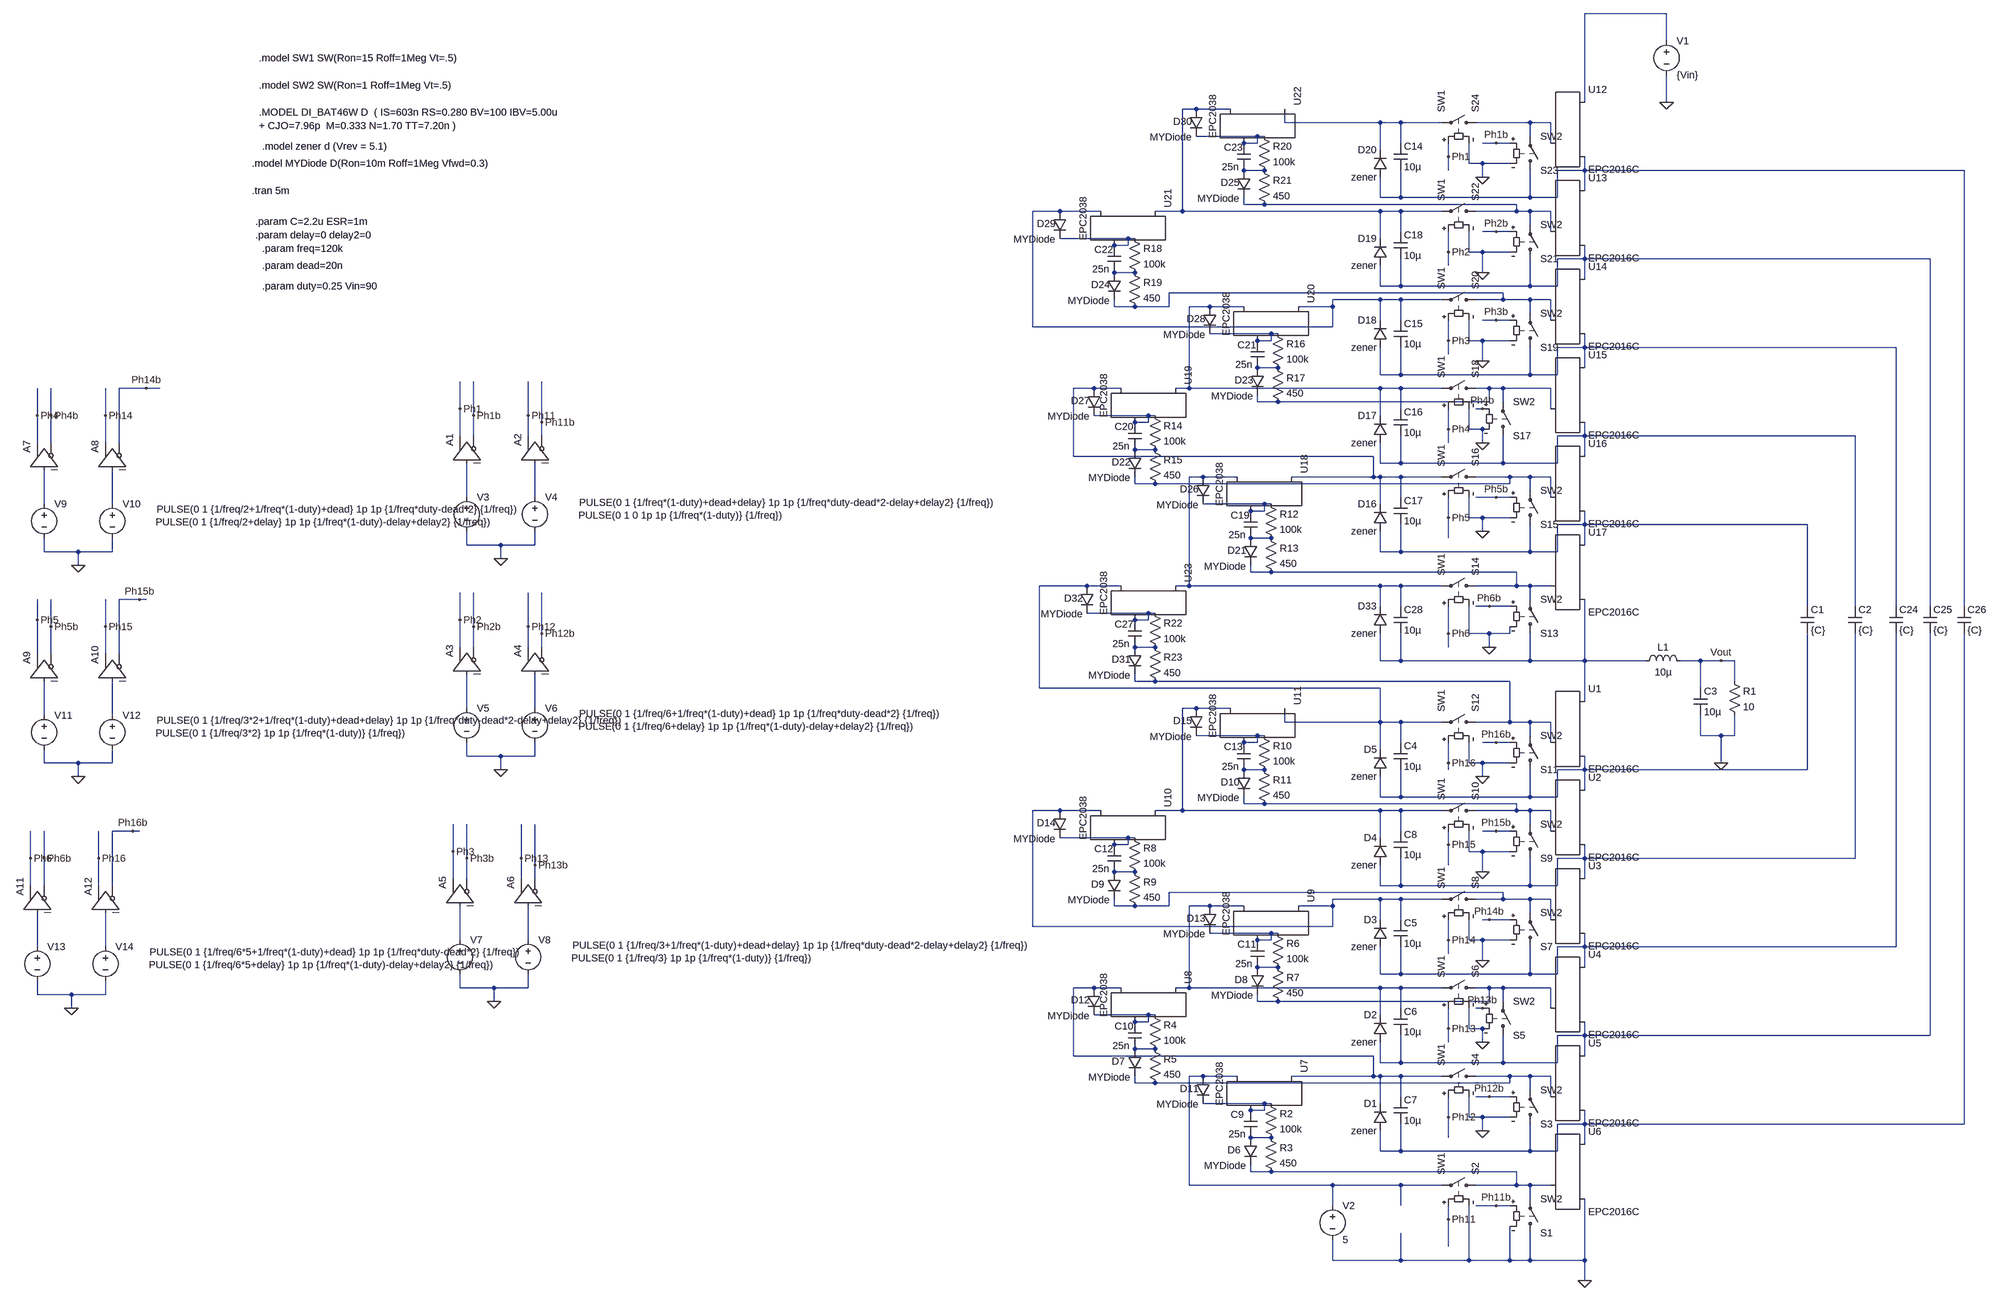
[diagram p0: schematic synchronousBootstrap2.asc]
synchronousBootstrap2.asc, the LTspice schematic file:
Version 4
SHEET 1 3480 1524
WIRE 1120 -1904 928 -1904
WIRE 1120 -1840 1120 -1904
WIRE 928 -1696 928 -1904
WIRE 1120 -1696 1120 -1760
WIRE 16 -1680 -16 -1680
WIRE 96 -1680 16 -1680
WIRE 224 -1648 224 -1680
WIRE 448 -1648 224 -1648
WIRE 496 -1648 448 -1648
WIRE 592 -1648 496 -1648
WIRE 800 -1648 672 -1648
WIRE 848 -1648 800 -1648
WIRE 160 -1616 16 -1616
WIRE 176 -1616 160 -1616
WIRE 800 -1616 800 -1648
WIRE 160 -1600 160 -1616
WIRE 160 -1600 128 -1600
WIRE 496 -1600 496 -1648
WIRE 720 -1600 688 -1600
WIRE 752 -1600 720 -1600
WIRE 848 -1600 848 -1648
WIRE 448 -1584 448 -1648
WIRE 608 -1568 608 -1600
WIRE 656 -1552 656 -1600
WIRE 688 -1552 656 -1552
WIRE 752 -1552 688 -1552
WIRE 176 -1536 128 -1536
WIRE 608 -1536 608 -1568
WIRE 928 -1536 928 -1568
WIRE 928 -1536 864 -1536
WIRE 1872 -1536 928 -1536
WIRE 688 -1520 688 -1552
WIRE 928 -1488 928 -1536
WIRE 448 -1472 448 -1520
WIRE 496 -1472 496 -1536
WIRE 496 -1472 448 -1472
WIRE 800 -1472 800 -1536
WIRE 800 -1472 496 -1472
WIRE 864 -1472 864 -1536
WIRE 864 -1472 800 -1472
WIRE 128 -1456 128 -1472
WIRE 176 -1456 128 -1456
WIRE 768 -1456 176 -1456
WIRE -304 -1440 -368 -1440
WIRE -208 -1440 -304 -1440
WIRE -16 -1440 -16 -1680
WIRE -16 -1440 -80 -1440
WIRE 448 -1440 -16 -1440
WIRE 496 -1440 448 -1440
WIRE 592 -1440 496 -1440
WIRE 768 -1440 768 -1456
WIRE 768 -1440 672 -1440
WIRE 800 -1440 768 -1440
WIRE 848 -1440 800 -1440
WIRE 800 -1408 800 -1440
WIRE 496 -1392 496 -1440
WIRE 720 -1392 688 -1392
WIRE 752 -1392 720 -1392
WIRE 848 -1392 848 -1440
WIRE -144 -1376 -304 -1376
WIRE -128 -1376 -144 -1376
WIRE 448 -1376 448 -1440
WIRE -144 -1360 -144 -1376
WIRE -144 -1360 -176 -1360
WIRE 608 -1344 608 -1392
WIRE 656 -1344 656 -1392
WIRE 688 -1344 656 -1344
WIRE 752 -1344 688 -1344
WIRE 928 -1328 928 -1360
WIRE 928 -1328 864 -1328
WIRE 1792 -1328 928 -1328
WIRE 608 -1312 608 -1344
WIRE -128 -1296 -176 -1296
WIRE 688 -1296 688 -1344
WIRE 928 -1280 928 -1328
WIRE 448 -1264 448 -1312
WIRE 496 -1264 496 -1328
WIRE 496 -1264 448 -1264
WIRE 800 -1264 800 -1328
WIRE 800 -1264 496 -1264
WIRE 864 -1264 864 -1328
WIRE 864 -1264 800 -1264
WIRE 736 -1248 -48 -1248
WIRE 448 -1232 336 -1232
WIRE 496 -1232 448 -1232
WIRE 592 -1232 496 -1232
WIRE 736 -1232 736 -1248
WIRE 736 -1232 672 -1232
WIRE 800 -1232 736 -1232
WIRE 848 -1232 800 -1232
WIRE -176 -1216 -176 -1232
WIRE -128 -1216 -176 -1216
WIRE -48 -1216 -48 -1248
WIRE -48 -1216 -128 -1216
WIRE 48 -1216 0 -1216
WIRE 128 -1216 48 -1216
WIRE 336 -1216 336 -1232
WIRE 336 -1216 256 -1216
WIRE 800 -1200 800 -1232
WIRE 448 -1184 448 -1232
WIRE 496 -1184 496 -1232
WIRE 720 -1184 688 -1184
WIRE 752 -1184 720 -1184
WIRE 848 -1184 848 -1232
WIRE -368 -1168 -368 -1440
WIRE 336 -1168 336 -1216
WIRE 336 -1168 -368 -1168
WIRE 192 -1152 48 -1152
WIRE 208 -1152 192 -1152
WIRE 192 -1136 192 -1152
WIRE 192 -1136 160 -1136
WIRE 608 -1136 608 -1184
WIRE 656 -1136 656 -1184
WIRE 688 -1136 656 -1136
WIRE 752 -1136 688 -1136
WIRE 928 -1120 928 -1152
WIRE 928 -1120 864 -1120
WIRE 1712 -1120 928 -1120
WIRE 608 -1104 608 -1136
WIRE 688 -1088 688 -1136
WIRE 208 -1072 160 -1072
WIRE 928 -1072 928 -1120
WIRE 448 -1056 448 -1120
WIRE 496 -1056 496 -1120
WIRE 496 -1056 448 -1056
WIRE 800 -1056 800 -1120
WIRE 800 -1056 496 -1056
WIRE 864 -1056 864 -1120
WIRE 864 -1056 800 -1056
WIRE -2448 -1024 -2512 -1024
WIRE -2416 -1024 -2448 -1024
WIRE -224 -1024 -272 -1024
WIRE -160 -1024 -224 -1024
WIRE 0 -1024 0 -1216
WIRE 0 -1024 -32 -1024
WIRE 448 -1024 0 -1024
WIRE 496 -1024 448 -1024
WIRE 592 -1024 496 -1024
WIRE 704 -1024 672 -1024
WIRE 736 -1024 704 -1024
WIRE 848 -1024 736 -1024
WIRE 160 -992 160 -1008
WIRE 208 -992 160 -992
WIRE 704 -992 704 -1024
WIRE 704 -992 208 -992
WIRE 736 -992 736 -1024
WIRE -1712 -976 -1712 -1040
WIRE 496 -976 496 -1024
WIRE 688 -976 672 -976
WIRE 848 -976 848 -1024
WIRE -2704 -960 -2704 -1024
WIRE -2672 -960 -2672 -1024
WIRE -2544 -960 -2544 -1024
WIRE -1680 -960 -1680 -1040
WIRE -1552 -960 -1552 -1040
WIRE -96 -960 -224 -960
WIRE -80 -960 -96 -960
WIRE 448 -960 448 -1024
WIRE -1520 -944 -1520 -1040
WIRE -96 -944 -96 -960
WIRE -96 -944 -128 -944
WIRE 608 -928 608 -976
WIRE 656 -928 656 -976
WIRE 688 -928 656 -928
WIRE -1712 -912 -1712 -976
WIRE -1680 -912 -1680 -960
WIRE -1552 -912 -1552 -960
WIRE -1520 -912 -1520 -944
WIRE 928 -912 928 -944
WIRE 928 -912 864 -912
WIRE 1616 -912 928 -912
WIRE -2704 -896 -2704 -960
WIRE -2672 -896 -2672 -960
WIRE -2544 -896 -2544 -960
WIRE -2512 -896 -2512 -1024
WIRE 608 -896 608 -928
WIRE 688 -896 688 -928
WIRE -80 -880 -128 -880
WIRE -272 -864 -272 -1024
WIRE 432 -864 -272 -864
WIRE 928 -864 928 -912
WIRE 448 -848 448 -896
WIRE 496 -848 496 -912
WIRE 496 -848 448 -848
WIRE 736 -848 736 -912
WIRE 736 -848 496 -848
WIRE 864 -848 864 -912
WIRE 864 -848 736 -848
WIRE 32 -816 0 -816
WIRE 112 -816 32 -816
WIRE 432 -816 432 -864
WIRE 432 -816 240 -816
WIRE 448 -816 432 -816
WIRE 496 -816 448 -816
WIRE 592 -816 496 -816
WIRE 752 -816 672 -816
WIRE 800 -816 752 -816
WIRE 848 -816 800 -816
WIRE -128 -800 -128 -816
WIRE -80 -800 -128 -800
WIRE 752 -800 752 -816
WIRE 752 -800 -80 -800
WIRE 800 -784 800 -816
WIRE -1696 -768 -1696 -848
WIRE -1536 -768 -1536 -848
WIRE 496 -768 496 -816
WIRE 720 -768 672 -768
WIRE 752 -768 720 -768
WIRE 848 -768 848 -816
WIRE -2688 -752 -2688 -832
WIRE -2528 -752 -2528 -832
WIRE 176 -752 32 -752
WIRE 192 -752 176 -752
WIRE 448 -752 448 -816
WIRE 176 -736 176 -752
WIRE 176 -736 144 -736
WIRE 608 -720 608 -768
WIRE 656 -720 656 -768
WIRE 688 -720 656 -720
WIRE 752 -720 688 -720
WIRE 928 -704 928 -736
WIRE 928 -704 864 -704
WIRE 1504 -704 928 -704
WIRE 688 -688 688 -720
WIRE 192 -672 144 -672
WIRE 608 -672 608 -720
WIRE -1696 -656 -1696 -688
WIRE -1616 -656 -1696 -656
WIRE -1536 -656 -1536 -688
WIRE -1536 -656 -1616 -656
WIRE 928 -656 928 -704
WIRE -2688 -640 -2688 -672
WIRE -2608 -640 -2688 -640
WIRE -2528 -640 -2528 -672
WIRE -2528 -640 -2608 -640
WIRE 448 -640 448 -688
WIRE 496 -640 496 -704
WIRE 496 -640 448 -640
WIRE 800 -640 800 -704
WIRE 800 -640 496 -640
WIRE 864 -640 864 -704
WIRE 864 -640 800 -640
WIRE -1616 -624 -1616 -656
WIRE -2608 -608 -2608 -640
WIRE 144 -592 144 -608
WIRE 192 -592 144 -592
WIRE 768 -592 192 -592
WIRE -240 -560 -352 -560
WIRE -160 -560 -240 -560
WIRE 0 -560 0 -816
WIRE 0 -560 -32 -560
WIRE 448 -560 0 -560
WIRE 496 -560 448 -560
WIRE 592 -560 496 -560
WIRE 768 -560 768 -592
WIRE 768 -560 672 -560
WIRE 800 -560 768 -560
WIRE 848 -560 800 -560
WIRE -2464 -528 -2512 -528
WIRE -2448 -528 -2464 -528
WIRE 800 -528 800 -560
WIRE 448 -512 448 -560
WIRE 496 -512 496 -560
WIRE 704 -512 672 -512
WIRE 752 -512 704 -512
WIRE 1504 -512 1504 -704
WIRE 1616 -512 1616 -912
WIRE 1712 -512 1712 -1120
WIRE 1792 -512 1792 -1328
WIRE 1872 -512 1872 -1536
WIRE -96 -496 -240 -496
WIRE -80 -496 -96 -496
WIRE -2704 -480 -2704 -528
WIRE -1712 -480 -1712 -544
WIRE -96 -480 -96 -496
WIRE -96 -480 -128 -480
WIRE -2672 -464 -2672 -528
WIRE -2544 -464 -2544 -528
WIRE -1680 -464 -1680 -544
WIRE -1552 -464 -1552 -544
WIRE -1520 -448 -1520 -544
WIRE 608 -448 608 -512
WIRE 656 -448 656 -512
WIRE 704 -448 656 -448
WIRE 752 -448 752 -464
WIRE 752 -448 704 -448
WIRE -1712 -416 -1712 -480
WIRE -1680 -416 -1680 -464
WIRE -1552 -416 -1552 -464
WIRE -1520 -416 -1520 -448
WIRE -80 -416 -128 -416
WIRE 608 -416 608 -448
WIRE 704 -416 704 -448
WIRE -2704 -400 -2704 -480
WIRE -2672 -400 -2672 -464
WIRE -2544 -400 -2544 -464
WIRE -2512 -400 -2512 -528
WIRE 448 -384 448 -448
WIRE 496 -384 496 -448
WIRE 496 -384 448 -384
WIRE 800 -384 800 -448
WIRE 800 -384 496 -384
WIRE 928 -384 928 -528
WIRE 928 -384 800 -384
WIRE 1072 -384 928 -384
WIRE 1200 -384 1152 -384
WIRE 1248 -384 1200 -384
WIRE 1280 -384 1248 -384
WIRE -128 -336 -128 -352
WIRE -80 -336 -128 -336
WIRE 752 -336 -80 -336
WIRE 1280 -336 1280 -384
WIRE -352 -320 -352 -560
WIRE 448 -320 -352 -320
WIRE 1200 -320 1200 -384
WIRE 928 -288 928 -384
WIRE -1696 -272 -1696 -352
WIRE -1536 -272 -1536 -352
WIRE 16 -272 -16 -272
WIRE 96 -272 16 -272
WIRE -2688 -256 -2688 -336
WIRE -2528 -256 -2528 -336
WIRE 224 -240 224 -272
WIRE 448 -240 448 -320
WIRE 448 -240 224 -240
WIRE 496 -240 448 -240
WIRE 592 -240 496 -240
WIRE 752 -240 752 -336
WIRE 752 -240 672 -240
WIRE 800 -240 752 -240
WIRE 848 -240 800 -240
WIRE 160 -208 16 -208
WIRE 176 -208 160 -208
WIRE 800 -208 800 -240
WIRE 1200 -208 1200 -256
WIRE 1248 -208 1200 -208
WIRE 1280 -208 1280 -256
WIRE 1280 -208 1248 -208
WIRE 160 -192 160 -208
WIRE 160 -192 128 -192
WIRE 496 -192 496 -240
WIRE 720 -192 688 -192
WIRE 752 -192 720 -192
WIRE 848 -192 848 -240
WIRE 448 -176 448 -240
WIRE -1696 -160 -1696 -192
WIRE -1616 -160 -1696 -160
WIRE -1536 -160 -1536 -192
WIRE -1536 -160 -1616 -160
WIRE -2688 -144 -2688 -176
WIRE -2608 -144 -2688 -144
WIRE -2528 -144 -2528 -176
WIRE -2528 -144 -2608 -144
WIRE 608 -144 608 -192
WIRE 656 -144 656 -192
WIRE 688 -144 656 -144
WIRE 752 -144 688 -144
WIRE 1248 -144 1248 -208
WIRE -1616 -128 -1616 -160
WIRE 176 -128 128 -128
WIRE 608 -128 608 -144
WIRE 928 -128 928 -160
WIRE 928 -128 864 -128
WIRE 1504 -128 1504 -448
WIRE 1504 -128 928 -128
WIRE -2608 -112 -2608 -144
WIRE 688 -112 688 -144
WIRE 928 -80 928 -128
WIRE 448 -64 448 -112
WIRE 496 -64 496 -128
WIRE 496 -64 448 -64
WIRE 800 -64 800 -128
WIRE 800 -64 496 -64
WIRE 864 -64 864 -128
WIRE 864 -64 800 -64
WIRE 128 -48 128 -64
WIRE 176 -48 128 -48
WIRE 768 -48 176 -48
WIRE -304 -32 -368 -32
WIRE -208 -32 -304 -32
WIRE -16 -32 -16 -272
WIRE -16 -32 -80 -32
WIRE 448 -32 -16 -32
WIRE 496 -32 448 -32
WIRE 592 -32 496 -32
WIRE 768 -32 768 -48
WIRE 768 -32 672 -32
WIRE 800 -32 768 -32
WIRE 848 -32 800 -32
WIRE 800 0 800 -32
WIRE -2480 16 -2528 16
WIRE -2464 16 -2480 16
WIRE 496 16 496 -32
WIRE 720 16 688 16
WIRE 752 16 720 16
WIRE 848 16 848 -32
WIRE -144 32 -304 32
WIRE -128 32 -144 32
WIRE 448 32 448 -32
WIRE -144 48 -144 32
WIRE -144 48 -176 48
WIRE 608 48 608 16
WIRE -1728 64 -1728 0
WIRE 656 64 656 16
WIRE 688 64 656 64
WIRE 752 64 688 64
WIRE -2720 80 -2720 16
WIRE -2688 80 -2688 16
WIRE -2560 80 -2560 16
WIRE -1696 80 -1696 0
WIRE -1568 80 -1568 0
WIRE 928 80 928 48
WIRE 928 80 864 80
WIRE 1616 80 1616 -448
WIRE 1616 80 928 80
WIRE -1536 96 -1536 0
WIRE 608 96 608 48
WIRE -128 112 -176 112
WIRE 688 112 688 64
WIRE -1728 128 -1728 64
WIRE -1696 128 -1696 80
WIRE -1568 128 -1568 80
WIRE -1536 128 -1536 96
WIRE 928 128 928 80
WIRE -2720 144 -2720 80
WIRE -2688 144 -2688 80
WIRE -2560 144 -2560 80
WIRE -2528 144 -2528 16
WIRE 448 144 448 96
WIRE 496 144 496 80
WIRE 496 144 448 144
WIRE 800 144 800 80
WIRE 800 144 496 144
WIRE 864 144 864 80
WIRE 864 144 800 144
WIRE 736 160 -48 160
WIRE 448 176 336 176
WIRE 496 176 448 176
WIRE 592 176 496 176
WIRE 736 176 736 160
WIRE 736 176 672 176
WIRE 800 176 736 176
WIRE 848 176 800 176
WIRE -176 192 -176 176
WIRE -128 192 -176 192
WIRE -48 192 -48 160
WIRE -48 192 -128 192
WIRE 48 192 0 192
WIRE 128 192 48 192
WIRE 336 192 336 176
WIRE 336 192 256 192
WIRE 800 208 800 176
WIRE 448 224 448 176
WIRE 496 224 496 176
WIRE 704 224 688 224
WIRE 752 224 704 224
WIRE 848 224 848 176
WIRE -368 240 -368 -32
WIRE 336 240 336 192
WIRE 336 240 -368 240
WIRE 192 256 48 256
WIRE 208 256 192 256
WIRE -1712 272 -1712 192
WIRE -1552 272 -1552 192
WIRE 192 272 192 256
WIRE 192 272 160 272
WIRE 608 272 608 224
WIRE 656 272 656 224
WIRE 688 272 656 272
WIRE 752 272 688 272
WIRE -2704 288 -2704 208
WIRE -2544 288 -2544 208
WIRE 928 288 928 256
WIRE 928 288 864 288
WIRE 1712 288 1712 -448
WIRE 1712 288 928 288
WIRE 608 304 608 272
WIRE 688 320 688 272
WIRE 208 336 160 336
WIRE 928 336 928 288
WIRE 448 352 448 288
WIRE 496 352 496 288
WIRE 496 352 448 352
WIRE 800 352 800 288
WIRE 800 352 496 352
WIRE 864 352 864 288
WIRE 864 352 800 352
WIRE -1712 384 -1712 352
WIRE -1632 384 -1712 384
WIRE -1552 384 -1552 352
WIRE -1552 384 -1632 384
WIRE -224 384 -272 384
WIRE -160 384 -224 384
WIRE 0 384 0 192
WIRE 0 384 -32 384
WIRE 448 384 0 384
WIRE 496 384 448 384
WIRE 592 384 496 384
WIRE 704 384 672 384
WIRE 736 384 704 384
WIRE 848 384 736 384
WIRE -2704 400 -2704 368
WIRE -2624 400 -2704 400
WIRE -2544 400 -2544 368
WIRE -2544 400 -2624 400
WIRE -1632 416 -1632 384
WIRE 160 416 160 400
WIRE 208 416 160 416
WIRE 704 416 704 384
WIRE 704 416 208 416
WIRE 736 416 736 384
WIRE -2624 432 -2624 400
WIRE 496 432 496 384
WIRE 688 432 672 432
WIRE 848 432 848 384
WIRE -96 448 -224 448
WIRE -80 448 -96 448
WIRE 448 448 448 384
WIRE -96 464 -96 448
WIRE -96 464 -128 464
WIRE 608 480 608 432
WIRE 656 480 656 432
WIRE 688 480 656 480
WIRE 928 496 928 464
WIRE 928 496 864 496
WIRE 1792 496 1792 -448
WIRE 1792 496 928 496
WIRE 608 512 608 480
WIRE 688 512 688 480
WIRE -80 528 -128 528
WIRE -272 544 -272 384
WIRE 432 544 -272 544
WIRE 928 544 928 496
WIRE 448 560 448 512
WIRE 496 560 496 496
WIRE 496 560 448 560
WIRE 736 560 736 496
WIRE 736 560 496 560
WIRE 864 560 864 496
WIRE 864 560 736 560
WIRE 32 592 0 592
WIRE 112 592 32 592
WIRE 432 592 432 544
WIRE 432 592 240 592
WIRE 448 592 432 592
WIRE 496 592 448 592
WIRE 592 592 496 592
WIRE 752 592 672 592
WIRE 800 592 752 592
WIRE 848 592 800 592
WIRE -128 608 -128 592
WIRE -80 608 -128 608
WIRE 752 608 752 592
WIRE 752 608 -80 608
WIRE 800 624 800 592
WIRE 496 640 496 592
WIRE 704 640 672 640
WIRE 752 640 704 640
WIRE 848 640 848 592
WIRE 176 656 32 656
WIRE 192 656 176 656
WIRE 448 656 448 592
WIRE 176 672 176 656
WIRE 176 672 144 672
WIRE 608 688 608 640
WIRE 656 688 656 640
WIRE 688 688 656 688
WIRE 752 688 688 688
WIRE 928 704 928 672
WIRE 928 704 864 704
WIRE 1872 704 1872 -448
WIRE 1872 704 928 704
WIRE 688 720 688 688
WIRE 192 736 144 736
WIRE 608 736 608 688
WIRE 928 752 928 704
WIRE 448 768 448 720
WIRE 496 768 496 704
WIRE 496 768 448 768
WIRE 800 768 800 704
WIRE 800 768 496 768
WIRE 864 768 864 704
WIRE 864 768 800 768
WIRE 144 816 144 800
WIRE 192 816 144 816
WIRE 768 816 192 816
WIRE 0 848 0 592
WIRE 336 848 0 848
WIRE 496 848 336 848
WIRE 592 848 496 848
WIRE 768 848 768 816
WIRE 768 848 672 848
WIRE 800 848 768 848
WIRE 848 848 800 848
WIRE 800 880 800 848
WIRE 336 896 336 848
WIRE 496 896 496 848
WIRE 720 896 672 896
WIRE 752 896 720 896
WIRE 608 928 608 896
WIRE 608 992 608 928
WIRE 336 1024 336 976
WIRE 496 1024 496 960
WIRE 496 1024 336 1024
WIRE 656 1024 656 896
WIRE 656 1024 496 1024
WIRE 752 1024 752 944
WIRE 752 1024 656 1024
WIRE 800 1024 800 960
WIRE 800 1024 752 1024
WIRE 928 1024 928 880
WIRE 928 1024 800 1024
WIRE 928 1072 928 1024
FLAG 928 1072 0
FLAG 1248 -144 0
FLAG -1616 -624 0
FLAG -1712 -976 Ph1
FLAG -1680 -960 Ph1b
FLAG -1552 -960 Ph11
FLAG -1520 -944 Ph11b
FLAG -1616 -128 0
FLAG -1712 -480 Ph2
FLAG -1680 -464 Ph2b
FLAG -1552 -464 Ph12
FLAG -1520 -448 Ph12b
FLAG -1632 416 0
FLAG -1728 64 Ph3
FLAG -1696 80 Ph3b
FLAG -1568 80 Ph13
FLAG -1536 96 Ph13b
FLAG 688 -112 0
FLAG 688 112 0
FLAG 688 320 0
FLAG 688 512 0
FLAG 688 720 0
FLAG 1248 -384 Vout
FLAG 608 -1568 Ph1
FLAG 720 -1600 Ph1b
FLAG 608 -1344 Ph2
FLAG 720 -1392 Ph2b
FLAG 608 -1136 Ph3
FLAG 720 -1184 Ph3b
FLAG 688 -1520 0
FLAG 688 -1296 0
FLAG 688 -1088 0
FLAG 688 -896 0
FLAG 688 -688 0
FLAG 1120 -1696 0
FLAG 608 -928 Ph4
FLAG 688 -976 Ph4b
FLAG 608 -720 Ph5
FLAG 720 -768 Ph5b
FLAG 608 -448 Ph6
FLAG 704 -512 Ph6b
FLAG 608 928 Ph11
FLAG 720 896 Ph11b
FLAG 608 688 Ph12
FLAG 704 640 Ph12b
FLAG 608 480 Ph13
FLAG 688 432 Ph13b
FLAG 608 272 Ph14
FLAG 704 224 Ph14b
FLAG 608 48 Ph15
FLAG 720 16 Ph15b
FLAG 608 -144 Ph16
FLAG 720 -192 Ph16b
FLAG -2608 -608 0
FLAG -2608 -112 0
FLAG -2624 432 0
FLAG -2704 -960 Ph4
FLAG -2672 -960 Ph4b
FLAG -2544 -960 Ph14
FLAG -2448 -1024 Ph14b
FLAG -2704 -480 Ph5
FLAG -2672 -464 Ph5b
FLAG -2544 -464 Ph15
FLAG -2464 -528 Ph15b
FLAG -2720 80 Ph6
FLAG -2688 80 Ph6b
FLAG -2560 80 Ph16
FLAG -2480 16 Ph16b
FLAG 704 -416 0
SYMBOL EPCGaN 848 -192 R0
SYMATTR InstName U1
SYMATTR Value EPC2016C
SYMBOL EPCGaN 848 16 R0
SYMATTR InstName U2
SYMATTR Value EPC2016C
SYMBOL EPCGaN 848 224 R0
SYMATTR InstName U3
SYMATTR Value EPC2016C
SYMBOL EPCGaN 848 432 R0
SYMATTR InstName U4
SYMATTR Value EPC2016C
SYMBOL EPCGaN 848 640 R0
SYMATTR InstName U5
SYMATTR Value EPC2016C
SYMBOL EPCGaN 848 848 R0
SYMATTR InstName U6
SYMATTR Value EPC2016C
SYMBOL cap 1488 -512 R0
SYMATTR InstName C1
SYMATTR Value {C}
SYMATTR SpiceLine Rser={ESR}
SYMATTR SpiceLine2 IC={Vin/6}
SYMBOL ind 1168 -368 M270
WINDOW 0 32 56 VTop 2
WINDOW 3 5 56 VBottom 2
SYMATTR InstName L1
SYMATTR Value 10µ
SYMATTR SpiceLine Rser=1m
SYMBOL cap 1184 -320 R0
SYMATTR InstName C3
SYMATTR Value 10µ
SYMATTR SpiceLine Rser=1m
SYMATTR SpiceLine2 IC={Vin*duty}
SYMBOL res 1264 -352 R0
SYMATTR InstName R1
SYMATTR Value 10
SYMBOL sw 800 976 M180
SYMATTR InstName S1
SYMATTR Value SW2
SYMBOL sw 688 848 M270
SYMATTR InstName S2
SYMATTR Value SW1
SYMBOL voltage 336 880 R0
WINDOW 123 0 0 Left 2
WINDOW 39 0 0 Left 2
SYMATTR InstName V2
SYMATTR Value 5
SYMBOL sw 800 720 M180
SYMATTR InstName S3
SYMATTR Value SW2
SYMBOL sw 688 592 M270
SYMATTR InstName S4
SYMATTR Value SW1
SYMBOL sw 736 512 M180
SYMATTR InstName S5
SYMATTR Value SW2
SYMBOL sw 688 384 M270
SYMATTR InstName S6
SYMATTR Value SW1
SYMBOL sw 800 304 M180
SYMATTR InstName S7
SYMATTR Value SW2
SYMBOL sw 688 176 M270
SYMATTR InstName S8
SYMATTR Value SW1
SYMBOL sw 800 96 M180
SYMATTR InstName S9
SYMATTR Value SW2
SYMBOL sw 688 -32 M270
SYMATTR InstName S10
SYMATTR Value SW1
SYMBOL sw 800 -112 M180
SYMATTR InstName S11
SYMATTR Value SW2
SYMBOL sw 688 -240 M270
SYMATTR InstName S12
SYMATTR Value SW1
SYMBOL voltage -1696 -784 R0
WINDOW 3 264 28 Left 2
WINDOW 123 0 0 Left 2
WINDOW 39 0 0 Left 2
SYMATTR Value PULSE(0 1 {1/freq*(1-duty)+dead+delay} 1p 1p {1/freq*duty-dead*2-delay+delay2} {1/freq})
SYMATTR InstName V3
SYMBOL voltage -1536 -784 R0
WINDOW 3 102 58 Left 2
WINDOW 123 0 0 Left 2
WINDOW 39 0 0 Left 2
SYMATTR Value PULSE(0 1 0 1p 1p {1/freq*(1-duty)} {1/freq})
SYMATTR InstName V4
SYMBOL Digital\\buf -1760 -848 R270
SYMATTR InstName A1
SYMBOL Digital\\buf -1600 -848 R270
SYMATTR InstName A2
SYMBOL voltage -1696 -288 R0
WINDOW 3 264 28 Left 2
WINDOW 123 0 0 Left 2
WINDOW 39 0 0 Left 2
SYMATTR Value PULSE(0 1 {1/freq/6+1/freq*(1-duty)+dead} 1p 1p {1/freq*duty-dead*2} {1/freq})
SYMATTR InstName V5
SYMBOL voltage -1536 -288 R0
WINDOW 3 102 58 Left 2
WINDOW 123 0 0 Left 2
WINDOW 39 0 0 Left 2
SYMATTR Value PULSE(0 1 {1/freq/6+delay} 1p 1p {1/freq*(1-duty)-delay+delay2} {1/freq})
SYMATTR InstName V6
SYMBOL Digital\\buf -1760 -352 R270
SYMATTR InstName A3
SYMBOL Digital\\buf -1600 -352 R270
SYMATTR InstName A4
SYMBOL voltage -1712 256 R0
WINDOW 3 264 28 Left 2
WINDOW 123 0 0 Left 2
WINDOW 39 0 0 Left 2
SYMATTR Value PULSE(0 1 {1/freq/3+1/freq*(1-duty)+dead+delay} 1p 1p {1/freq*duty-dead*2-delay+delay2} {1/freq})
SYMATTR InstName V7
SYMBOL voltage -1552 256 R0
WINDOW 3 102 58 Left 2
WINDOW 123 0 0 Left 2
WINDOW 39 0 0 Left 2
SYMATTR Value PULSE(0 1 {1/freq/3} 1p 1p {1/freq*(1-duty)} {1/freq})
SYMATTR InstName V8
SYMBOL Digital\\buf -1776 192 R270
SYMATTR InstName A5
SYMBOL Digital\\buf -1616 192 R270
SYMATTR InstName A6
SYMBOL cap 480 -192 R0
SYMATTR InstName C4
SYMATTR Value 10µ
SYMATTR SpiceLine ic=5
SYMBOL cap 480 224 R0
SYMATTR InstName C5
SYMATTR Value 10µ
SYMATTR SpiceLine ic=5
SYMBOL cap 480 432 R0
SYMATTR InstName C6
SYMATTR Value 10µ
SYMATTR SpiceLine IC=5
SYMBOL cap 480 640 R0
SYMATTR InstName C7
SYMATTR Value 10µ
SYMATTR SpiceLine IC=5
SYMBOL cap 480 16 R0
SYMATTR InstName C8
SYMATTR Value 10µ
SYMATTR SpiceLine ic=5
SYMBOL diode 464 720 R180
WINDOW 0 24 64 Left 2
WINDOW 3 24 0 Left 2
SYMATTR InstName D1
SYMATTR Value zener
SYMATTR SpiceLine ic=5
SYMBOL diode 464 512 R180
WINDOW 0 24 64 Left 2
WINDOW 3 24 0 Left 2
SYMATTR InstName D2
SYMATTR Value zener
SYMATTR SpiceLine ic=5
SYMBOL diode 464 288 R180
WINDOW 0 24 64 Left 2
WINDOW 3 24 0 Left 2
SYMATTR InstName D3
SYMATTR Value zener
SYMBOL diode 464 96 R180
WINDOW 0 24 64 Left 2
WINDOW 3 24 0 Left 2
SYMATTR InstName D4
SYMATTR Value zener
SYMBOL diode 464 -112 R180
WINDOW 0 24 64 Left 2
WINDOW 3 24 0 Left 2
SYMATTR InstName D5
SYMATTR Value zener
SYMBOL EPCGaN 144 672 M270
WINDOW 3 11 73 Left 2
SYMATTR Value EPC2038
SYMATTR InstName U7
SYMBOL cap 128 672 R0
WINDOW 0 -31 10 Left 2
WINDOW 3 -36 56 Left 2
SYMATTR InstName C9
SYMATTR Value 25n
SYMBOL res 176 640 R0
SYMATTR InstName R2
SYMATTR Value 100k
SYMBOL res 176 720 R0
SYMATTR InstName R3
SYMATTR Value 450
SYMBOL diode 128 736 R0
WINDOW 0 -38 29 Left 2
WINDOW 3 -93 66 Left 2
SYMATTR InstName D6
SYMATTR Value MYDiode
SYMBOL EPCGaN -128 464 M270
WINDOW 3 11 73 Left 2
SYMATTR Value EPC2038
SYMATTR InstName U8
SYMBOL cap -144 464 R0
WINDOW 0 -31 10 Left 2
WINDOW 3 -36 56 Left 2
SYMATTR InstName C10
SYMATTR Value 25n
SYMBOL res -96 432 R0
SYMATTR InstName R4
SYMATTR Value 100k
SYMBOL res -96 512 R0
SYMATTR InstName R5
SYMATTR Value 450
SYMBOL diode -144 528 R0
WINDOW 0 -38 29 Left 2
WINDOW 3 -93 66 Left 2
SYMATTR InstName D7
SYMATTR Value MYDiode
SYMBOL EPCGaN 160 272 M270
WINDOW 3 11 73 Left 2
SYMATTR Value EPC2038
SYMATTR InstName U9
SYMBOL cap 144 272 R0
WINDOW 0 -31 10 Left 2
WINDOW 3 -36 56 Left 2
SYMATTR InstName C11
SYMATTR Value 25n
SYMBOL res 192 240 R0
SYMATTR InstName R6
SYMATTR Value 100k
SYMBOL res 192 320 R0
SYMATTR InstName R7
SYMATTR Value 450
SYMBOL diode 144 336 R0
WINDOW 0 -38 29 Left 2
WINDOW 3 -93 66 Left 2
SYMATTR InstName D8
SYMATTR Value MYDiode
SYMBOL EPCGaN -176 48 M270
WINDOW 3 11 73 Left 2
SYMATTR Value EPC2038
SYMATTR InstName U10
SYMBOL cap -192 48 R0
WINDOW 0 -31 10 Left 2
WINDOW 3 -36 56 Left 2
SYMATTR InstName C12
SYMATTR Value 25n
SYMBOL res -144 16 R0
SYMATTR InstName R8
SYMATTR Value 100k
SYMBOL res -144 96 R0
SYMATTR InstName R9
SYMATTR Value 450
SYMBOL diode -192 112 R0
WINDOW 0 -38 29 Left 2
WINDOW 3 -93 66 Left 2
SYMATTR InstName D9
SYMATTR Value MYDiode
SYMBOL EPCGaN 128 -192 M270
WINDOW 3 11 73 Left 2
SYMATTR Value EPC2038
SYMATTR InstName U11
SYMBOL cap 112 -192 R0
WINDOW 0 -31 10 Left 2
WINDOW 3 -36 56 Left 2
SYMATTR InstName C13
SYMATTR Value 25n
SYMBOL res 160 -224 R0
SYMATTR InstName R10
SYMATTR Value 100k
SYMBOL res 160 -144 R0
SYMATTR InstName R11
SYMATTR Value 450
SYMBOL diode 112 -128 R0
WINDOW 0 -38 29 Left 2
WINDOW 3 -93 66 Left 2
SYMATTR InstName D10
SYMATTR Value MYDiode
SYMBOL diode 16 592 R0
WINDOW 0 -38 29 Left 2
WINDOW 3 -93 66 Left 2
SYMATTR InstName D11
SYMATTR Value MYDiode
SYMBOL diode -240 384 R0
WINDOW 0 -38 29 Left 2
WINDOW 3 -93 66 Left 2
SYMATTR InstName D12
SYMATTR Value MYDiode
SYMBOL diode 32 192 R0
WINDOW 0 -38 29 Left 2
WINDOW 3 -93 66 Left 2
SYMATTR InstName D13
SYMATTR Value MYDiode
SYMBOL diode -320 -32 R0
WINDOW 0 -38 29 Left 2
WINDOW 3 -93 66 Left 2
SYMATTR InstName D14
SYMATTR Value MYDiode
SYMBOL diode 0 -272 R0
WINDOW 0 -38 29 Left 2
WINDOW 3 -93 66 Left 2
SYMATTR InstName D15
SYMATTR Value MYDiode
SYMBOL EPCGaN 848 -1600 R0
SYMATTR InstName U12
SYMATTR Value EPC2016C
SYMBOL EPCGaN 848 -1392 R0
SYMATTR InstName U13
SYMATTR Value EPC2016C
SYMBOL EPCGaN 848 -1184 R0
SYMATTR InstName U14
SYMATTR Value EPC2016C
SYMBOL EPCGaN 848 -976 R0
SYMATTR InstName U15
SYMATTR Value EPC2016C
SYMBOL EPCGaN 848 -768 R0
SYMATTR InstName U16
SYMATTR Value EPC2016C
SYMBOL EPCGaN 848 -560 R0
SYMATTR InstName U17
SYMATTR Value EPC2016C
SYMBOL sw 800 -432 M180
SYMATTR InstName S13
SYMATTR Value SW2
SYMBOL sw 688 -560 M270
SYMATTR InstName S14
SYMATTR Value SW1
SYMBOL sw 800 -688 M180
SYMATTR InstName S15
SYMATTR Value SW2
SYMBOL sw 688 -816 M270
SYMATTR InstName S16
SYMATTR Value SW1
SYMBOL sw 736 -896 M180
SYMATTR InstName S17
SYMATTR Value SW2
SYMBOL sw 688 -1024 M270
SYMATTR InstName S18
SYMATTR Value SW1
SYMBOL sw 800 -1104 M180
SYMATTR InstName S19
SYMATTR Value SW2
SYMBOL sw 688 -1232 M270
SYMATTR InstName S20
SYMATTR Value SW1
SYMBOL sw 800 -1312 M180
SYMATTR InstName S21
SYMATTR Value SW2
SYMBOL sw 688 -1440 M270
SYMATTR InstName S22
SYMATTR Value SW1
SYMBOL sw 800 -1520 M180
SYMATTR InstName S23
SYMATTR Value SW2
SYMBOL sw 688 -1648 M270
SYMATTR InstName S24
SYMATTR Value SW1
SYMBOL cap 480 -1600 R0
SYMATTR InstName C14
SYMATTR Value 10µ
SYMATTR SpiceLine ic=5
SYMBOL cap 480 -1184 R0
SYMATTR InstName C15
SYMATTR Value 10µ
SYMATTR SpiceLine ic=5
SYMBOL cap 480 -976 R0
SYMATTR InstName C16
SYMATTR Value 10µ
SYMATTR SpiceLine IC=5
SYMBOL cap 480 -768 R0
SYMATTR InstName C17
SYMATTR Value 10µ
SYMATTR SpiceLine IC=5
SYMBOL cap 480 -1392 R0
SYMATTR InstName C18
SYMATTR Value 10µ
SYMATTR SpiceLine ic=5
SYMBOL diode 464 -688 R180
WINDOW 0 24 64 Left 2
WINDOW 3 24 0 Left 2
SYMATTR InstName D16
SYMATTR Value zener
SYMATTR SpiceLine ic=5
SYMBOL diode 464 -896 R180
WINDOW 0 24 64 Left 2
WINDOW 3 24 0 Left 2
SYMATTR InstName D17
SYMATTR Value zener
SYMATTR SpiceLine ic=5
SYMBOL diode 464 -1120 R180
WINDOW 0 24 64 Left 2
WINDOW 3 24 0 Left 2
SYMATTR InstName D18
SYMATTR Value zener
SYMBOL diode 464 -1312 R180
WINDOW 0 24 64 Left 2
WINDOW 3 24 0 Left 2
SYMATTR InstName D19
SYMATTR Value zener
SYMBOL diode 464 -1520 R180
WINDOW 0 24 64 Left 2
WINDOW 3 24 0 Left 2
SYMATTR InstName D20
SYMATTR Value zener
SYMBOL EPCGaN 144 -736 M270
WINDOW 3 11 73 Left 2
SYMATTR Value EPC2038
SYMATTR InstName U18
SYMBOL cap 128 -736 R0
WINDOW 0 -31 10 Left 2
WINDOW 3 -36 56 Left 2
SYMATTR InstName C19
SYMATTR Value 25n
SYMBOL res 176 -768 R0
SYMATTR InstName R12
SYMATTR Value 100k
SYMBOL res 176 -688 R0
SYMATTR InstName R13
SYMATTR Value 450
SYMBOL diode 128 -672 R0
WINDOW 0 -38 29 Left 2
WINDOW 3 -93 66 Left 2
SYMATTR InstName D21
SYMATTR Value MYDiode
SYMBOL EPCGaN -128 -944 M270
WINDOW 3 11 73 Left 2
SYMATTR Value EPC2038
SYMATTR InstName U19
SYMBOL cap -144 -944 R0
WINDOW 0 -31 10 Left 2
WINDOW 3 -36 56 Left 2
SYMATTR InstName C20
SYMATTR Value 25n
SYMBOL res -96 -976 R0
SYMATTR InstName R14
SYMATTR Value 100k
SYMBOL res -96 -896 R0
SYMATTR InstName R15
SYMATTR Value 450
SYMBOL diode -144 -880 R0
WINDOW 0 -38 29 Left 2
WINDOW 3 -93 66 Left 2
SYMATTR InstName D22
SYMATTR Value MYDiode
SYMBOL EPCGaN 160 -1136 M270
WINDOW 3 11 73 Left 2
SYMATTR Value EPC2038
SYMATTR InstName U20
SYMBOL cap 144 -1136 R0
WINDOW 0 -31 10 Left 2
WINDOW 3 -36 56 Left 2
SYMATTR InstName C21
SYMATTR Value 25n
SYMBOL res 192 -1168 R0
SYMATTR InstName R16
SYMATTR Value 100k
SYMBOL res 192 -1088 R0
SYMATTR InstName R17
SYMATTR Value 450
SYMBOL diode 144 -1072 R0
WINDOW 0 -38 29 Left 2
WINDOW 3 -93 66 Left 2
SYMATTR InstName D23
SYMATTR Value MYDiode
SYMBOL EPCGaN -176 -1360 M270
WINDOW 3 11 73 Left 2
SYMATTR Value EPC2038
SYMATTR InstName U21
SYMBOL cap -192 -1360 R0
WINDOW 0 -31 10 Left 2
WINDOW 3 -36 56 Left 2
SYMATTR InstName C22
SYMATTR Value 25n
SYMBOL res -144 -1392 R0
SYMATTR InstName R18
SYMATTR Value 100k
SYMBOL res -144 -1312 R0
SYMATTR InstName R19
SYMATTR Value 450
SYMBOL diode -192 -1296 R0
WINDOW 0 -38 29 Left 2
WINDOW 3 -93 66 Left 2
SYMATTR InstName D24
SYMATTR Value MYDiode
SYMBOL EPCGaN 128 -1600 M270
WINDOW 3 11 73 Left 2
SYMATTR Value EPC2038
SYMATTR InstName U22
SYMBOL cap 112 -1600 R0
WINDOW 0 -31 10 Left 2
WINDOW 3 -36 56 Left 2
SYMATTR InstName C23
SYMATTR Value 25n
SYMBOL res 160 -1632 R0
SYMATTR InstName R20
SYMATTR Value 100k
SYMBOL res 160 -1552 R0
SYMATTR InstName R21
SYMATTR Value 450
SYMBOL diode 112 -1536 R0
WINDOW 0 -38 29 Left 2
WINDOW 3 -93 66 Left 2
SYMATTR InstName D25
SYMATTR Value MYDiode
SYMBOL diode 16 -816 R0
WINDOW 0 -38 29 Left 2
WINDOW 3 -93 66 Left 2
SYMATTR InstName D26
SYMATTR Value MYDiode
SYMBOL diode -240 -1024 R0
WINDOW 0 -38 29 Left 2
WINDOW 3 -93 66 Left 2
SYMATTR InstName D27
SYMATTR Value MYDiode
SYMBOL diode 32 -1216 R0
WINDOW 0 -38 29 Left 2
WINDOW 3 -93 66 Left 2
SYMATTR InstName D28
SYMATTR Value MYDiode
SYMBOL diode -320 -1440 R0
WINDOW 0 -38 29 Left 2
WINDOW 3 -93 66 Left 2
SYMATTR InstName D29
SYMATTR Value MYDiode
SYMBOL diode 0 -1680 R0
WINDOW 0 -38 29 Left 2
WINDOW 3 -93 66 Left 2
SYMATTR InstName D30
SYMATTR Value MYDiode
SYMBOL cap 1600 -512 R0
SYMATTR InstName C2
SYMATTR Value {C}
SYMATTR SpiceLine Rser={ESR}
SYMATTR SpiceLine2 IC={Vin/3}
SYMBOL cap 1696 -512 R0
SYMATTR InstName C24
SYMATTR Value {C}
SYMATTR SpiceLine Rser={ESR}
SYMATTR SpiceLine2 IC={Vin/2}
SYMBOL cap 1776 -512 R0
SYMATTR InstName C25
SYMATTR Value {C}
SYMATTR SpiceLine Rser={ESR}
SYMATTR SpiceLine2 IC={Vin/6*4}
SYMBOL cap 1856 -512 R0
SYMATTR InstName C26
SYMATTR Value {C}
SYMATTR SpiceLine Rser={ESR}
SYMATTR SpiceLine2 IC={Vin/6*5}
SYMBOL voltage 1120 -1856 R0
WINDOW 123 0 0 Left 2
WINDOW 39 0 0 Left 2
SYMATTR InstName V1
SYMATTR Value {Vin}
SYMBOL EPCGaN -128 -480 M270
WINDOW 3 11 73 Left 2
SYMATTR Value EPC2038
SYMATTR InstName U23
SYMBOL cap -144 -480 R0
WINDOW 0 -31 10 Left 2
WINDOW 3 -36 56 Left 2
SYMATTR InstName C27
SYMATTR Value 25n
SYMBOL res -96 -512 R0
SYMATTR InstName R22
SYMATTR Value 100k
SYMBOL res -96 -432 R0
SYMATTR InstName R23
SYMATTR Value 450
SYMBOL diode -144 -416 R0
WINDOW 0 -38 29 Left 2
WINDOW 3 -93 66 Left 2
SYMATTR InstName D31
SYMATTR Value MYDiode
SYMBOL diode -256 -560 R0
WINDOW 0 -38 29 Left 2
WINDOW 3 -93 66 Left 2
SYMATTR InstName D32
SYMATTR Value MYDiode
SYMBOL diode 464 -448 R180
WINDOW 0 24 64 Left 2
WINDOW 3 24 0 Left 2
SYMATTR InstName D33
SYMATTR Value zener
SYMBOL cap 480 -512 R0
SYMATTR InstName C28
SYMATTR Value 10µ
SYMATTR SpiceLine IC=5
SYMBOL voltage -2688 -768 R0
WINDOW 3 264 28 Left 2
WINDOW 123 0 0 Left 2
WINDOW 39 0 0 Left 2
SYMATTR Value PULSE(0 1 {1/freq/2+1/freq*(1-duty)+dead} 1p 1p {1/freq*duty-dead*2} {1/freq})
SYMATTR InstName V9
SYMBOL voltage -2528 -768 R0
WINDOW 3 102 58 Left 2
WINDOW 123 0 0 Left 2
WINDOW 39 0 0 Left 2
SYMATTR Value PULSE(0 1 {1/freq/2+delay} 1p 1p {1/freq*(1-duty)-delay+delay2} {1/freq})
SYMATTR InstName V10
SYMBOL Digital\\buf -2752 -832 R270
SYMATTR InstName A7
SYMBOL Digital\\buf -2592 -832 R270
SYMATTR InstName A8
SYMBOL voltage -2688 -272 R0
WINDOW 3 264 28 Left 2
WINDOW 123 0 0 Left 2
WINDOW 39 0 0 Left 2
SYMATTR Value PULSE(0 1 {1/freq/3*2+1/freq*(1-duty)+dead+delay} 1p 1p {1/freq*duty-dead*2-delay+delay2} {1/freq})
SYMATTR InstName V11
SYMBOL voltage -2528 -272 R0
WINDOW 3 102 58 Left 2
WINDOW 123 0 0 Left 2
WINDOW 39 0 0 Left 2
SYMATTR Value PULSE(0 1 {1/freq/3*2} 1p 1p {1/freq*(1-duty)} {1/freq})
SYMATTR InstName V12
SYMBOL Digital\\buf -2752 -336 R270
SYMATTR InstName A9
SYMBOL Digital\\buf -2592 -336 R270
SYMATTR InstName A10
SYMBOL voltage -2704 272 R0
WINDOW 3 264 28 Left 2
WINDOW 123 0 0 Left 2
WINDOW 39 0 0 Left 2
SYMATTR Value PULSE(0 1 {1/freq/6*5+1/freq*(1-duty)+dead} 1p 1p {1/freq*duty-dead*2} {1/freq})
SYMATTR InstName V13
SYMBOL voltage -2544 272 R0
WINDOW 3 102 58 Left 2
WINDOW 123 0 0 Left 2
WINDOW 39 0 0 Left 2
SYMATTR Value PULSE(0 1 {1/freq/6*5+delay} 1p 1p {1/freq*(1-duty)-delay+delay2} {1/freq})
SYMATTR InstName V14
SYMBOL Digital\\buf -2768 208 R270
SYMATTR InstName A11
SYMBOL Digital\\buf -2608 208 R270
SYMATTR InstName A12
TEXT -2184 -1672 Left 2 !.MODEL DI_BAT46W D  ( IS=603n RS=0.280 BV=100 IBV=5.00u \n+ CJO=7.96p  M=0.333 N=1.70 TT=7.20n )
TEXT -2184 -1800 Left 2 !.model SW1 SW(Ron=15 Roff=1Meg Vt=.5)
TEXT -2184 -1736 Left 2 !.model SW2 SW(Ron=1 Roff=1Meg Vt=.5)
TEXT -2176 -1592 Left 2 !.model zener d (Vrev = 5.1)
TEXT -2200 -1552 Left 2 !.model MYDiode D(Ron=10m Roff=1Meg Vfwd=0.3)
TEXT -2200 -1488 Left 2 !.tran 5m
TEXT -2192 -1416 Left 2 !.param C=2.2u ESR=1m
TEXT -2192 -1384 Left 2 !.param delay=0 delay2=0
TEXT -2176 -1352 Left 2 !.param freq=120k
TEXT -2176 -1312 Left 2 !.param dead=20n
TEXT -2176 -1264 Left 2 !.param duty=0.25 Vin=90

The netlist it stands for:
* synchronousBootstrap2.asc
XU1 N037 N036 N045 EPC2016C
XU2 N046 N045 N049 EPC2016C
XU3 N051 N049 N058 EPC2016C
XU4 N061 N058 N063 EPC2016C
XU5 N066 N063 N068 EPC2016C
XU6 N070 N068 0 EPC2016C
C1 N030 N045 {C} Rser={ESR} IC={Vin/6}
L1 Vout N036 10µ Rser=1m
C3 Vout 0 10µ Rser=1m IC={Vin*duty}
R1 Vout 0 10
S1 0 N070 Ph11b 0 SW2
S2 N070 N065 Ph11 0 SW1
V2 N065 0 5
S3 N068 N066 Ph12b 0 SW2
S4 N066 N060 Ph12 0 SW1
S5 N063 N061 Ph13b 0 SW2
S6 N061 N052 Ph13 0 SW1
S7 N058 N051 Ph14b 0 SW2
S8 N051 N047 Ph14 0 SW1
S9 N049 N046 Ph15b 0 SW2
S10 N046 N040 Ph15 0 SW1
S11 N045 N037 Ph16b 0 SW2
S12 N037 N033 Ph16 0 SW1
V3 N025 0 PULSE(0 1 {1/freq*(1-duty)+dead+delay} 1p 1p {1/freq*duty-dead*2-delay+delay2} {1/freq})
V4 N026 0 PULSE(0 1 0 1p 1p {1/freq*(1-duty)} {1/freq})
A1 N025 0 0 0 0 Ph1b Ph1 0 BUF
A2 N026 0 0 0 0 Ph11b Ph11 0 BUF
V5 N038 0 PULSE(0 1 {1/freq/6+1/freq*(1-duty)+dead} 1p 1p {1/freq*duty-dead*2} {1/freq})
V6 N039 0 PULSE(0 1 {1/freq/6+delay} 1p 1p {1/freq*(1-duty)-delay+delay2} {1/freq})
A3 N038 0 0 0 0 Ph2b Ph2 0 BUF
A4 N039 0 0 0 0 Ph12b Ph12 0 BUF
V7 N054 0 PULSE(0 1 {1/freq/3+1/freq*(1-duty)+dead+delay} 1p 1p {1/freq*duty-dead*2-delay+delay2} {1/freq})
V8 N055 0 PULSE(0 1 {1/freq/3} 1p 1p {1/freq*(1-duty)} {1/freq})
A5 N054 0 0 0 0 Ph3b Ph3 0 BUF
A6 N055 0 0 0 0 Ph13b Ph13 0 BUF
C4 N033 N045 10µ ic=5
C5 N047 N058 10µ ic=5
C6 N052 N063 10µ IC=5
C7 N060 N068 10µ IC=5
C8 N040 N049 10µ ic=5
D1 N068 N060 zener ic=5
D2 N063 N052 zener ic=5
D3 N058 N047 zener
D4 N049 N040 zener
D5 N045 N033 zener
XU7 N067 N060 N065 EPC2038
C9 N067 N069 25n
R2 N067 N069 100k
R3 N069 N070 450
D6 N069 N070 MYDiode
XU8 N062 N052 N060 EPC2038
C10 N062 N064 25n
R4 N062 N064 100k
R5 N064 N066 450
D7 N064 N066 MYDiode
XU9 N053 N047 N052 EPC2038
C11 N053 N059 25n
R6 N053 N059 100k
R7 N059 N061 450
D8 N059 N061 MYDiode
XU10 N048 N040 N047 EPC2038
C12 N048 N050 25n
R8 N048 N050 100k
R9 N050 N051 450
D9 N050 N051 MYDiode
XU11 N043 N033 N040 EPC2038
C13 N043 N044 25n
R10 N043 N044 100k
R11 N044 N046 450
D10 N044 N046 MYDiode
D11 N065 N067 MYDiode
D12 N060 N062 MYDiode
D13 N052 N053 MYDiode
D14 N047 N048 MYDiode
D15 N040 N043 MYDiode
XU12 N004 N001 N007 EPC2016C
XU13 N008 N007 N011 EPC2016C
XU14 N013 N011 N016 EPC2016C
XU15 N019 N016 N021 EPC2016C
XU16 N024 N021 N030 EPC2016C
XU17 N032 N030 N036 EPC2016C
S13 N036 N032 Ph6b 0 SW2
S14 N032 N023 Ph6 0 SW1
S15 N030 N024 Ph5b 0 SW2
S16 N024 N018 Ph5 0 SW1
S17 N021 N019 Ph4b 0 SW2
S18 N019 N014 Ph4 0 SW1
S19 N016 N013 Ph3b 0 SW2
S20 N013 N009 Ph3 0 SW1
S21 N011 N008 Ph2b 0 SW2
S22 N008 N002 Ph2 0 SW1
S23 N007 N004 Ph1b 0 SW2
S24 N004 N003 Ph1 0 SW1
C14 N003 N007 10µ ic=5
C15 N009 N016 10µ ic=5
C16 N014 N021 10µ IC=5
C17 N018 N030 10µ IC=5
C18 N002 N011 10µ ic=5
D16 N030 N018 zener ic=5
D17 N021 N014 zener ic=5
D18 N016 N009 zener
D19 N011 N002 zener
D20 N007 N003 zener
XU18 N029 N018 N023 EPC2038
C19 N029 N031 25n
R12 N029 N031 100k
R13 N031 N032 450
D21 N031 N032 MYDiode
XU19 N020 N014 N018 EPC2038
C20 N020 N022 25n
R14 N020 N022 100k
R15 N022 N024 450
D22 N022 N024 MYDiode
XU20 N015 N009 N014 EPC2038
C21 N015 N017 25n
R16 N015 N017 100k
R17 N017 N019 450
D23 N017 N019 MYDiode
XU21 N010 N002 N009 EPC2038
C22 N010 N012 25n
R18 N010 N012 100k
R19 N012 N013 450
D24 N012 N013 MYDiode
XU22 N005 N003 N002 EPC2038
C23 N005 N006 25n
R20 N005 N006 100k
R21 N006 N008 450
D25 N006 N008 MYDiode
D26 N023 N029 MYDiode
D27 N018 N020 MYDiode
D28 N014 N015 MYDiode
D29 N009 N010 MYDiode
D30 N002 N005 MYDiode
C2 N021 N049 {C} Rser={ESR} IC={Vin/3}
C24 N016 N058 {C} Rser={ESR} IC={Vin/2}
C25 N011 N063 {C} Rser={ESR} IC={Vin/6*4}
C26 N007 N068 {C} Rser={ESR} IC={Vin/6*5}
V1 N001 0 {Vin}
XU23 N034 N023 N033 EPC2038
C27 N034 N035 25n
R22 N034 N035 100k
R23 N035 N037 450
D31 N035 N037 MYDiode
D32 N033 N034 MYDiode
D33 N036 N023 zener
C28 N023 N036 10µ IC=5
V9 N027 0 PULSE(0 1 {1/freq/2+1/freq*(1-duty)+dead} 1p 1p {1/freq*duty-dead*2} {1/freq})
V10 N028 0 PULSE(0 1 {1/freq/2+delay} 1p 1p {1/freq*(1-duty)-delay+delay2} {1/freq})
A7 N027 0 0 0 0 Ph4b Ph4 0 BUF
A8 N028 0 0 0 0 Ph14b Ph14 0 BUF
V11 N041 0 PULSE(0 1 {1/freq/3*2+1/freq*(1-duty)+dead+delay} 1p 1p {1/freq*duty-dead*2-delay+delay2} {1/freq})
V12 N042 0 PULSE(0 1 {1/freq/3*2} 1p 1p {1/freq*(1-duty)} {1/freq})
A9 N041 0 0 0 0 Ph5b Ph5 0 BUF
A10 N042 0 0 0 0 Ph15b Ph15 0 BUF
V13 N056 0 PULSE(0 1 {1/freq/6*5+1/freq*(1-duty)+dead} 1p 1p {1/freq*duty-dead*2} {1/freq})
V14 N057 0 PULSE(0 1 {1/freq/6*5+delay} 1p 1p {1/freq*(1-duty)-delay+delay2} {1/freq})
A11 N056 0 0 0 0 Ph6b Ph6 0 BUF
A12 N057 0 0 0 0 Ph16b Ph16 0 BUF
.model D D
.lib standard.dio
.MODEL DI_BAT46W D  ( IS=603n RS=0.280 BV=100 IBV=5.00u
+ CJO=7.96p  M=0.333 N=1.70 TT=7.20n )
.model SW1 SW(Ron=15 Roff=1Meg Vt=.5)
.model SW2 SW(Ron=1 Roff=1Meg Vt=.5)
.model zener d (Vrev = 5.1)
.model MYDiode D(Ron=10m Roff=1Meg Vfwd=0.3)
.tran 5m
.param C=2.2u ESR=1m
.param delay=0 delay2=0
.param freq=120k
.param dead=20n
.param duty=0.25 Vin=90
.backanno
.end